# EAGLE schematic TR4 (EAGLE 9.6.2)
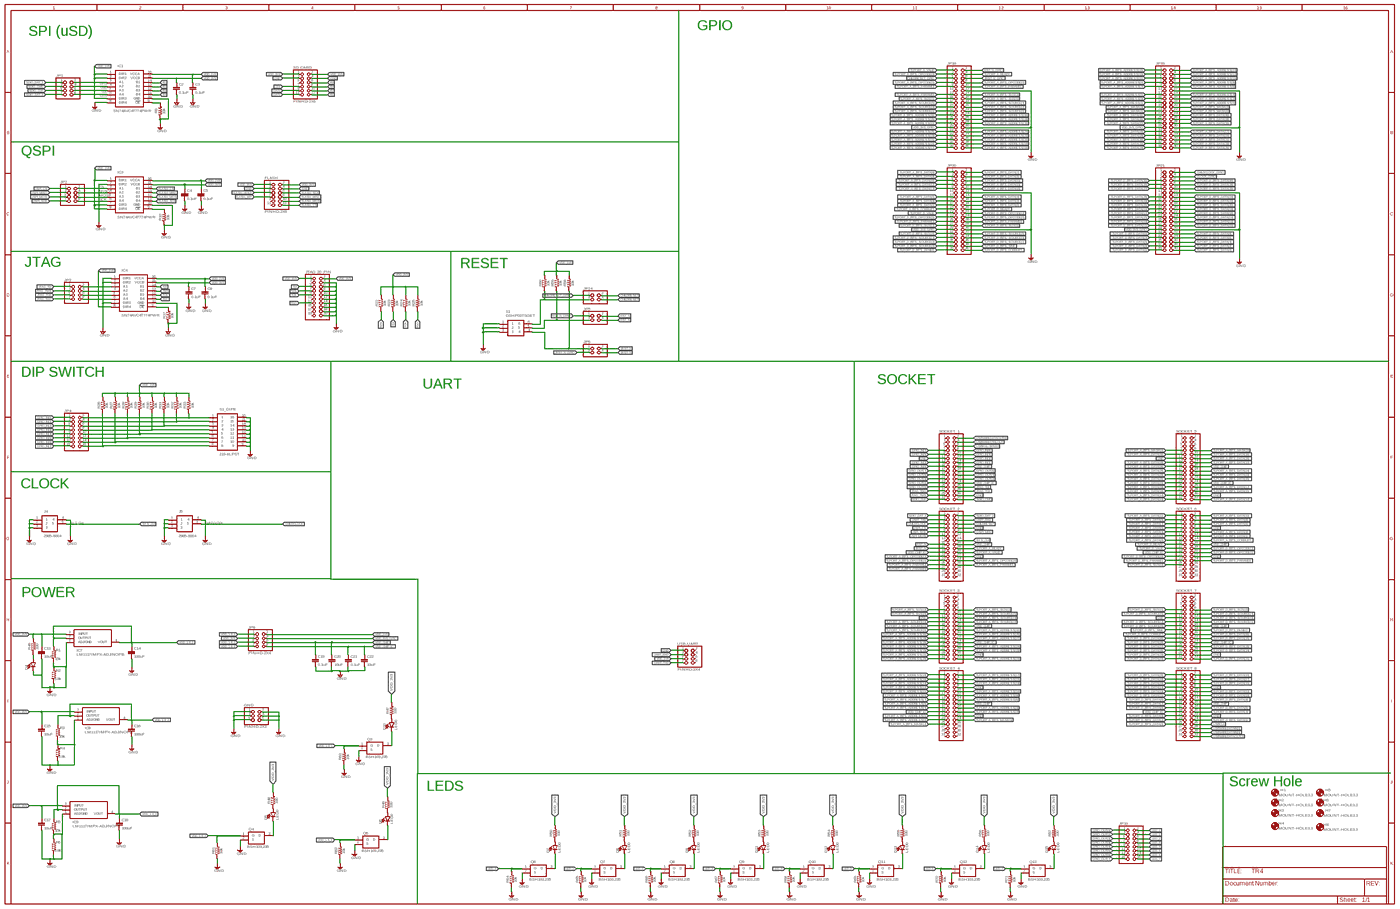
[diagram p0: schematic, sheet 1, overview]
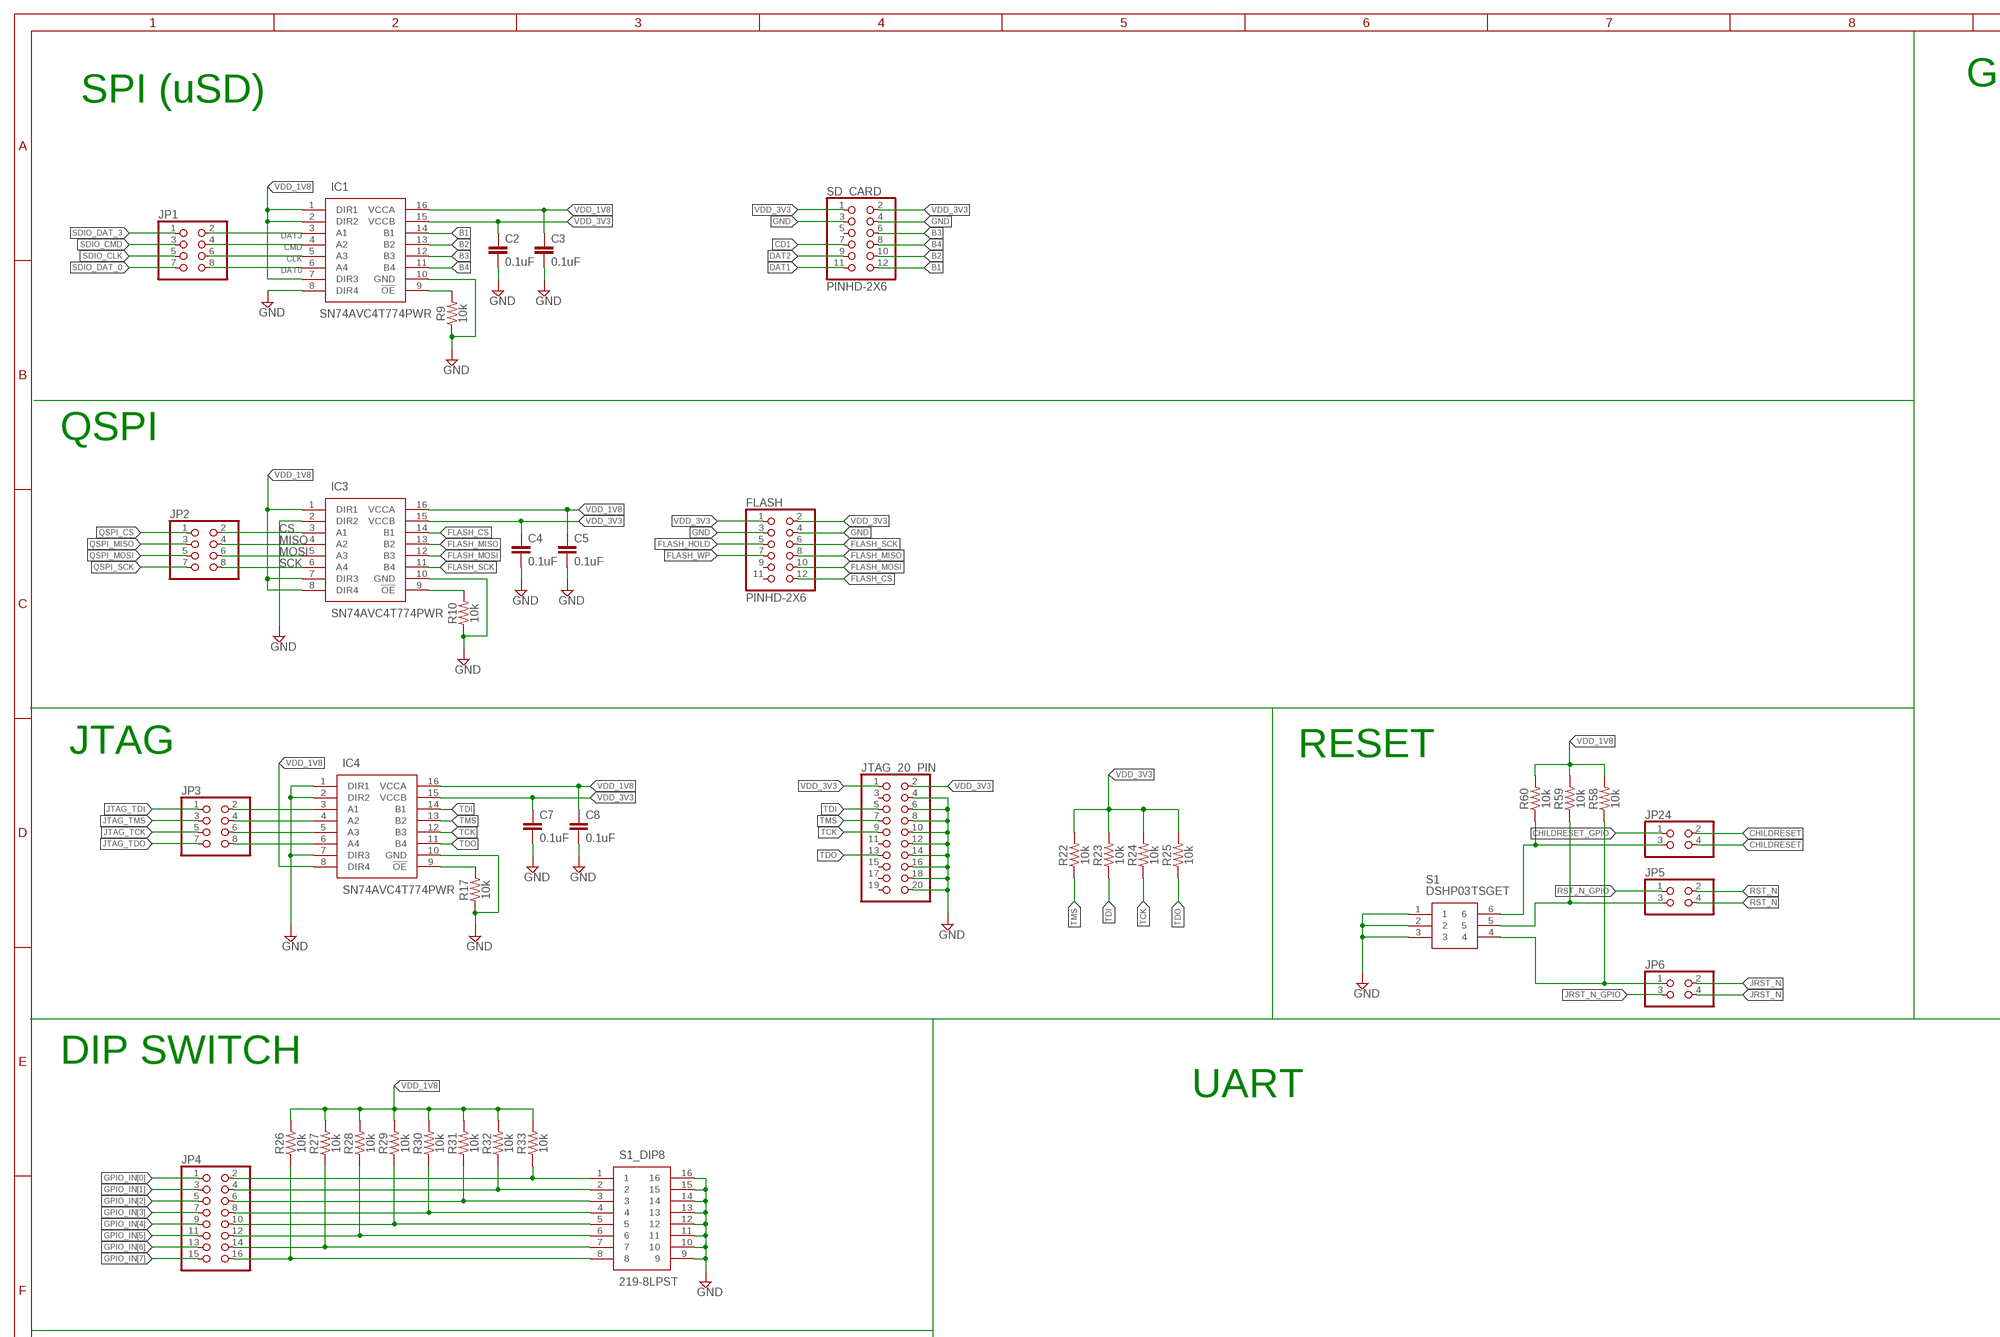
[diagram p1: schematic, sheet 1, part 1 of 4]
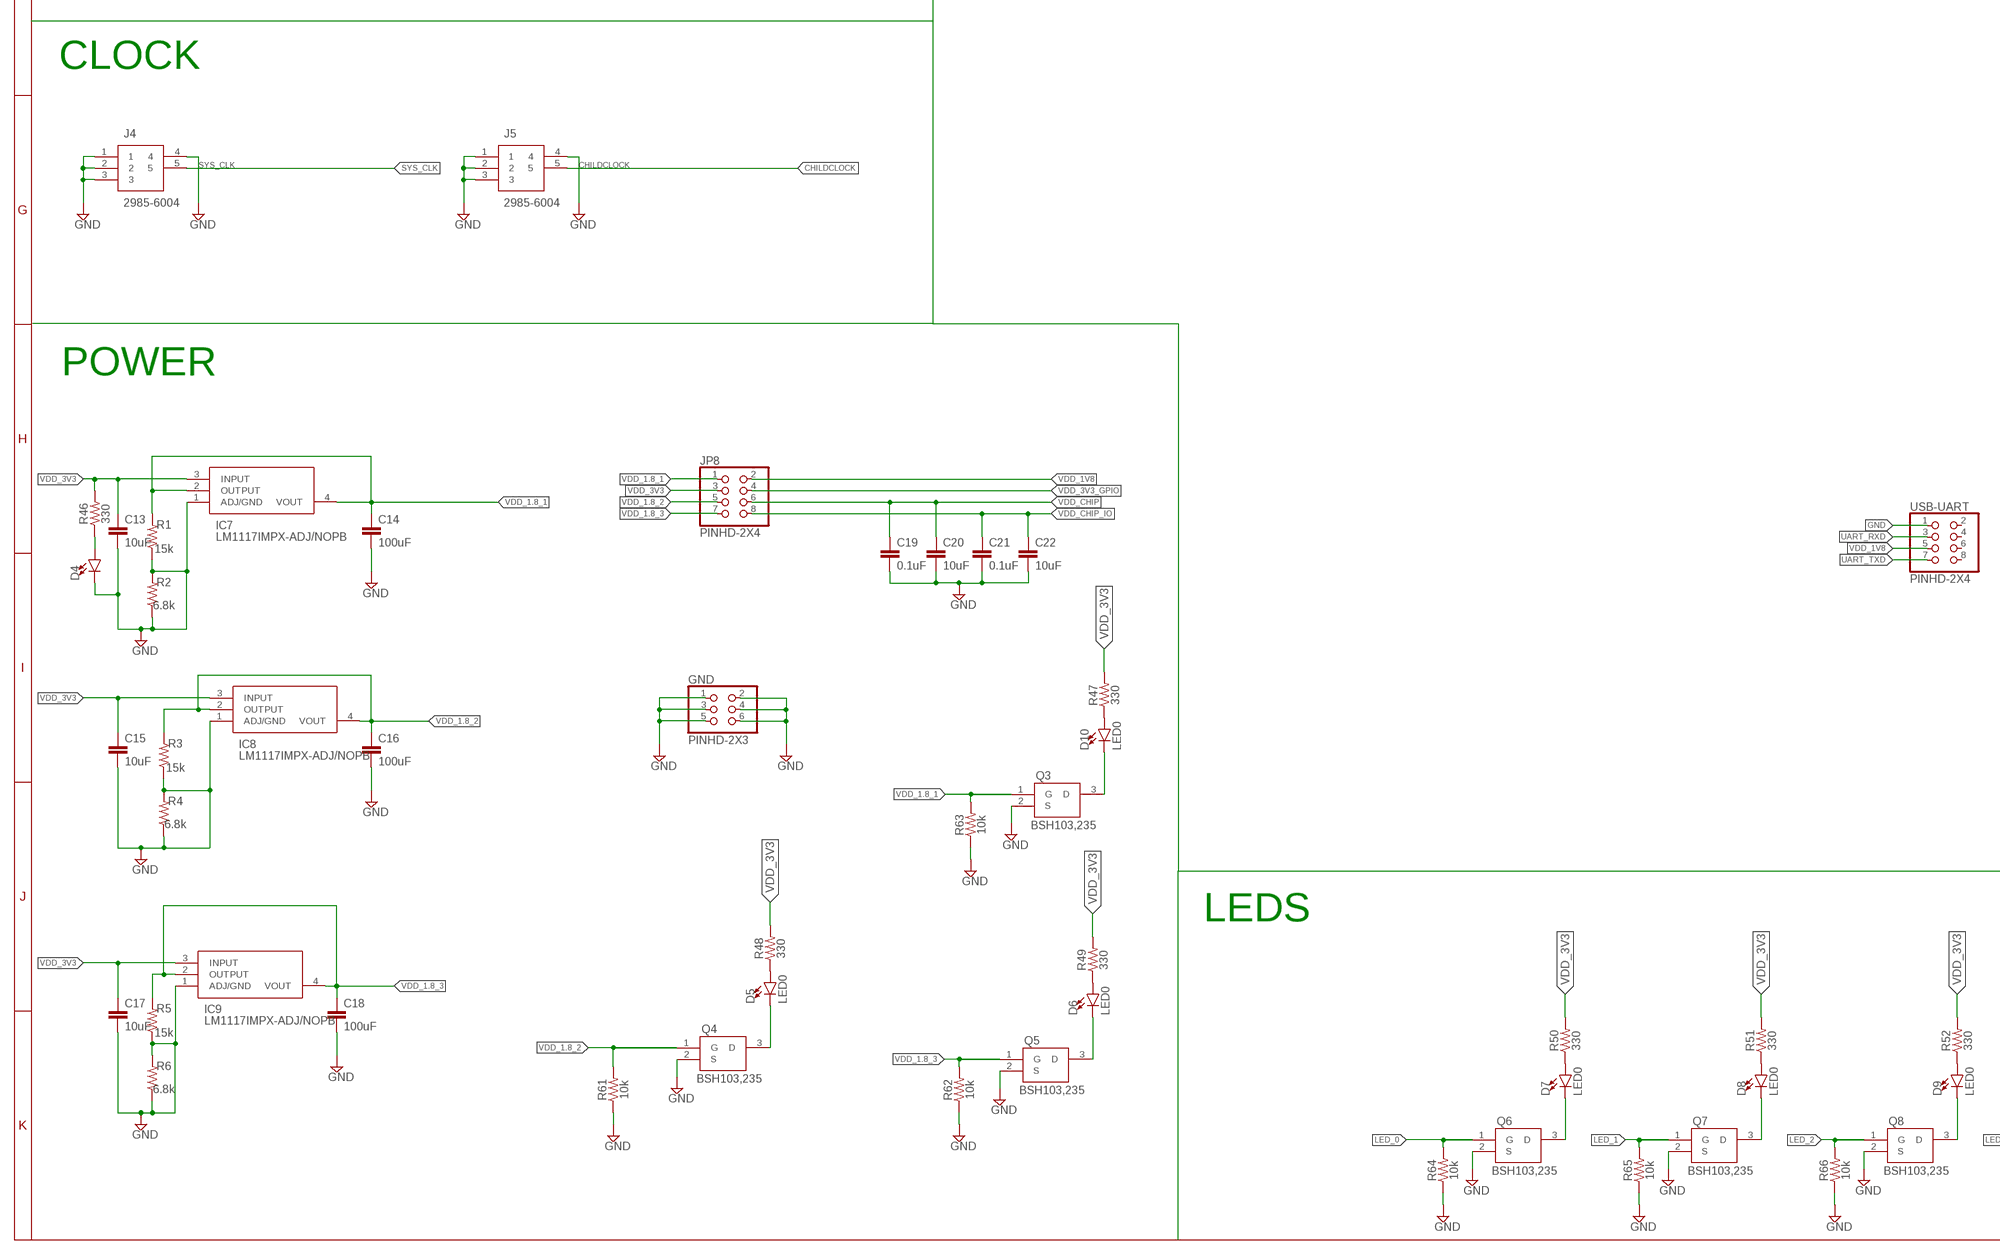
[diagram p2: schematic, sheet 1, part 2 of 4]
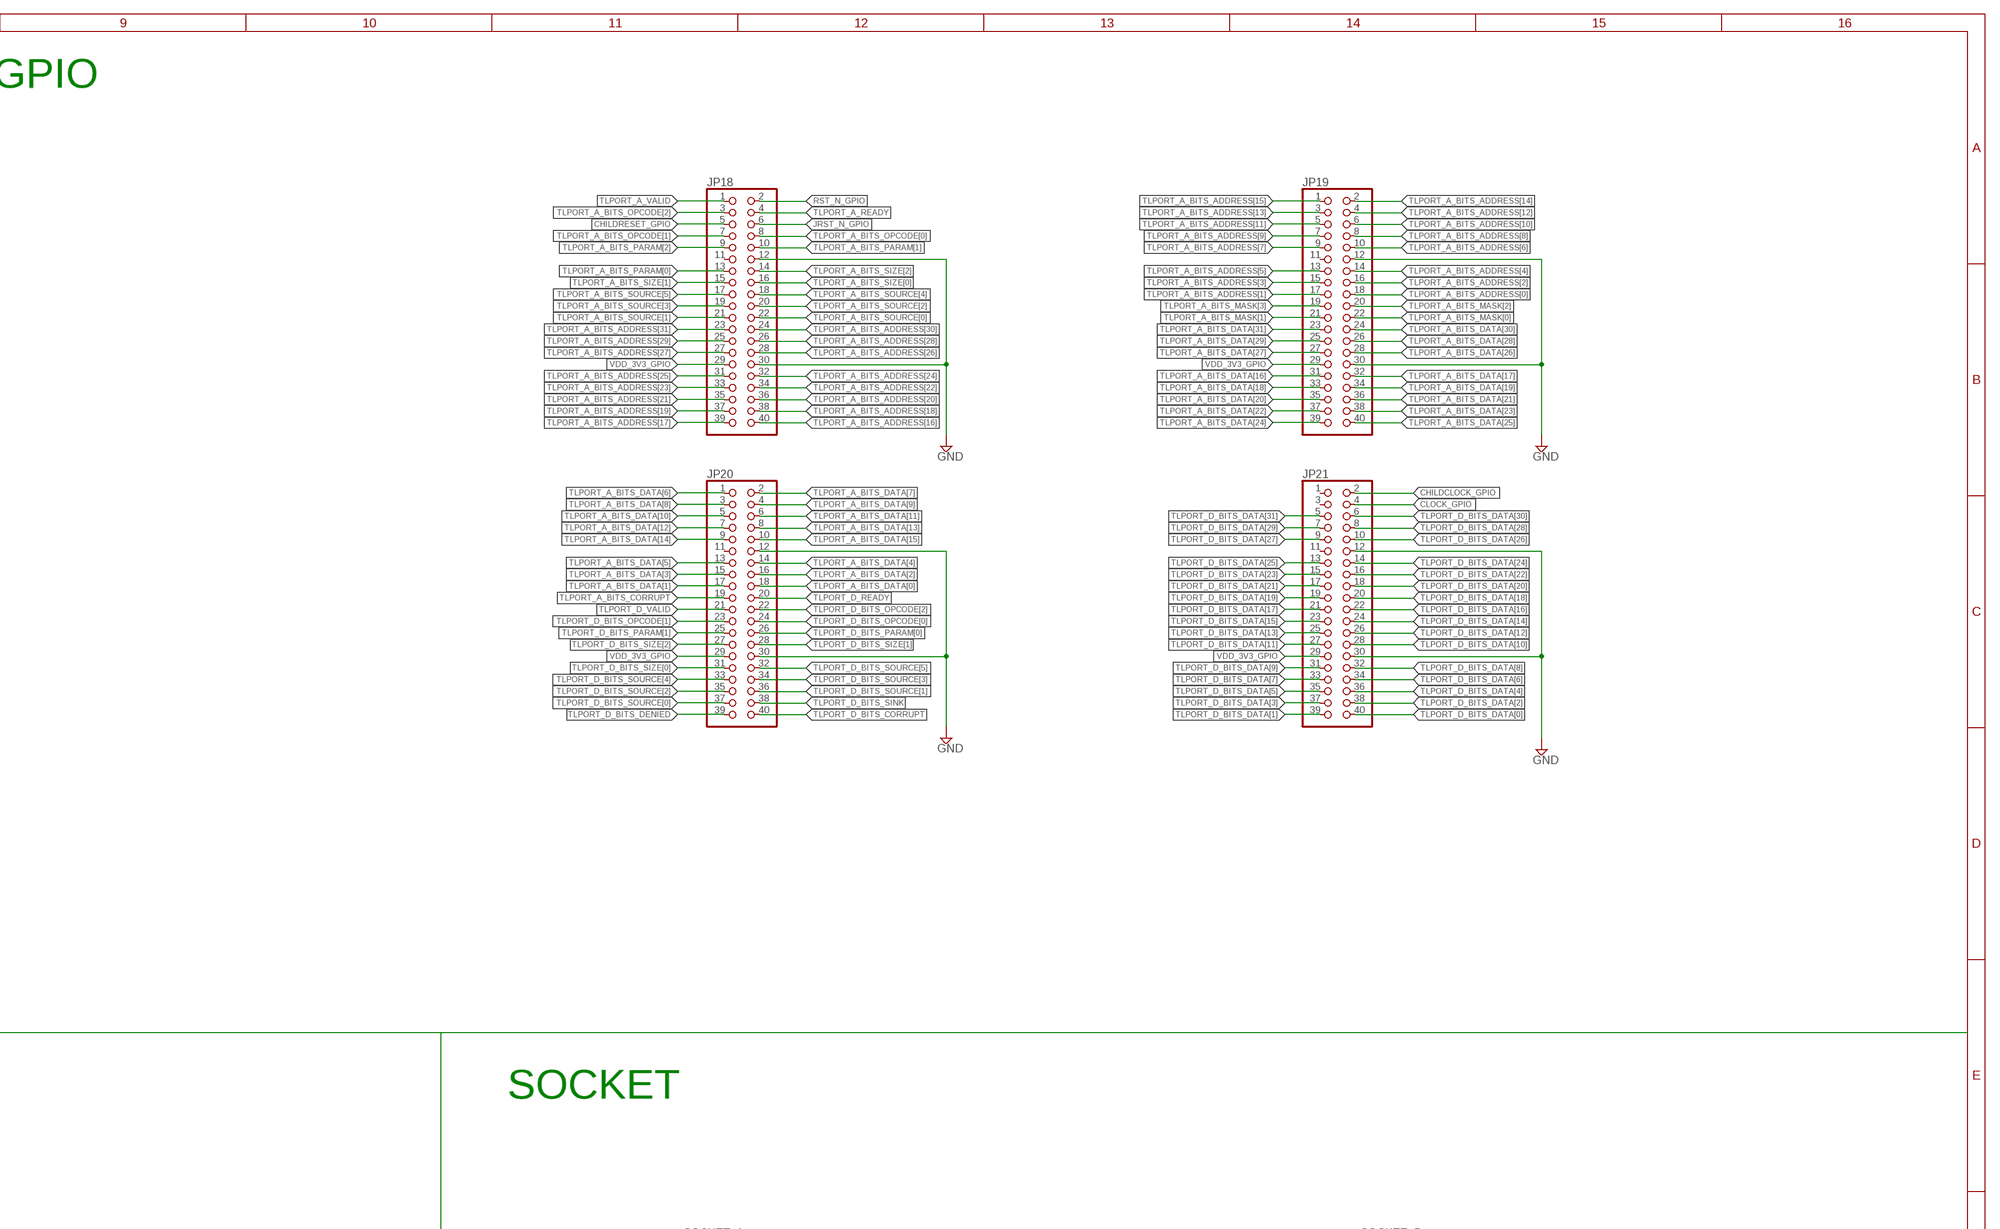
[diagram p3: schematic, sheet 1, part 3 of 4]
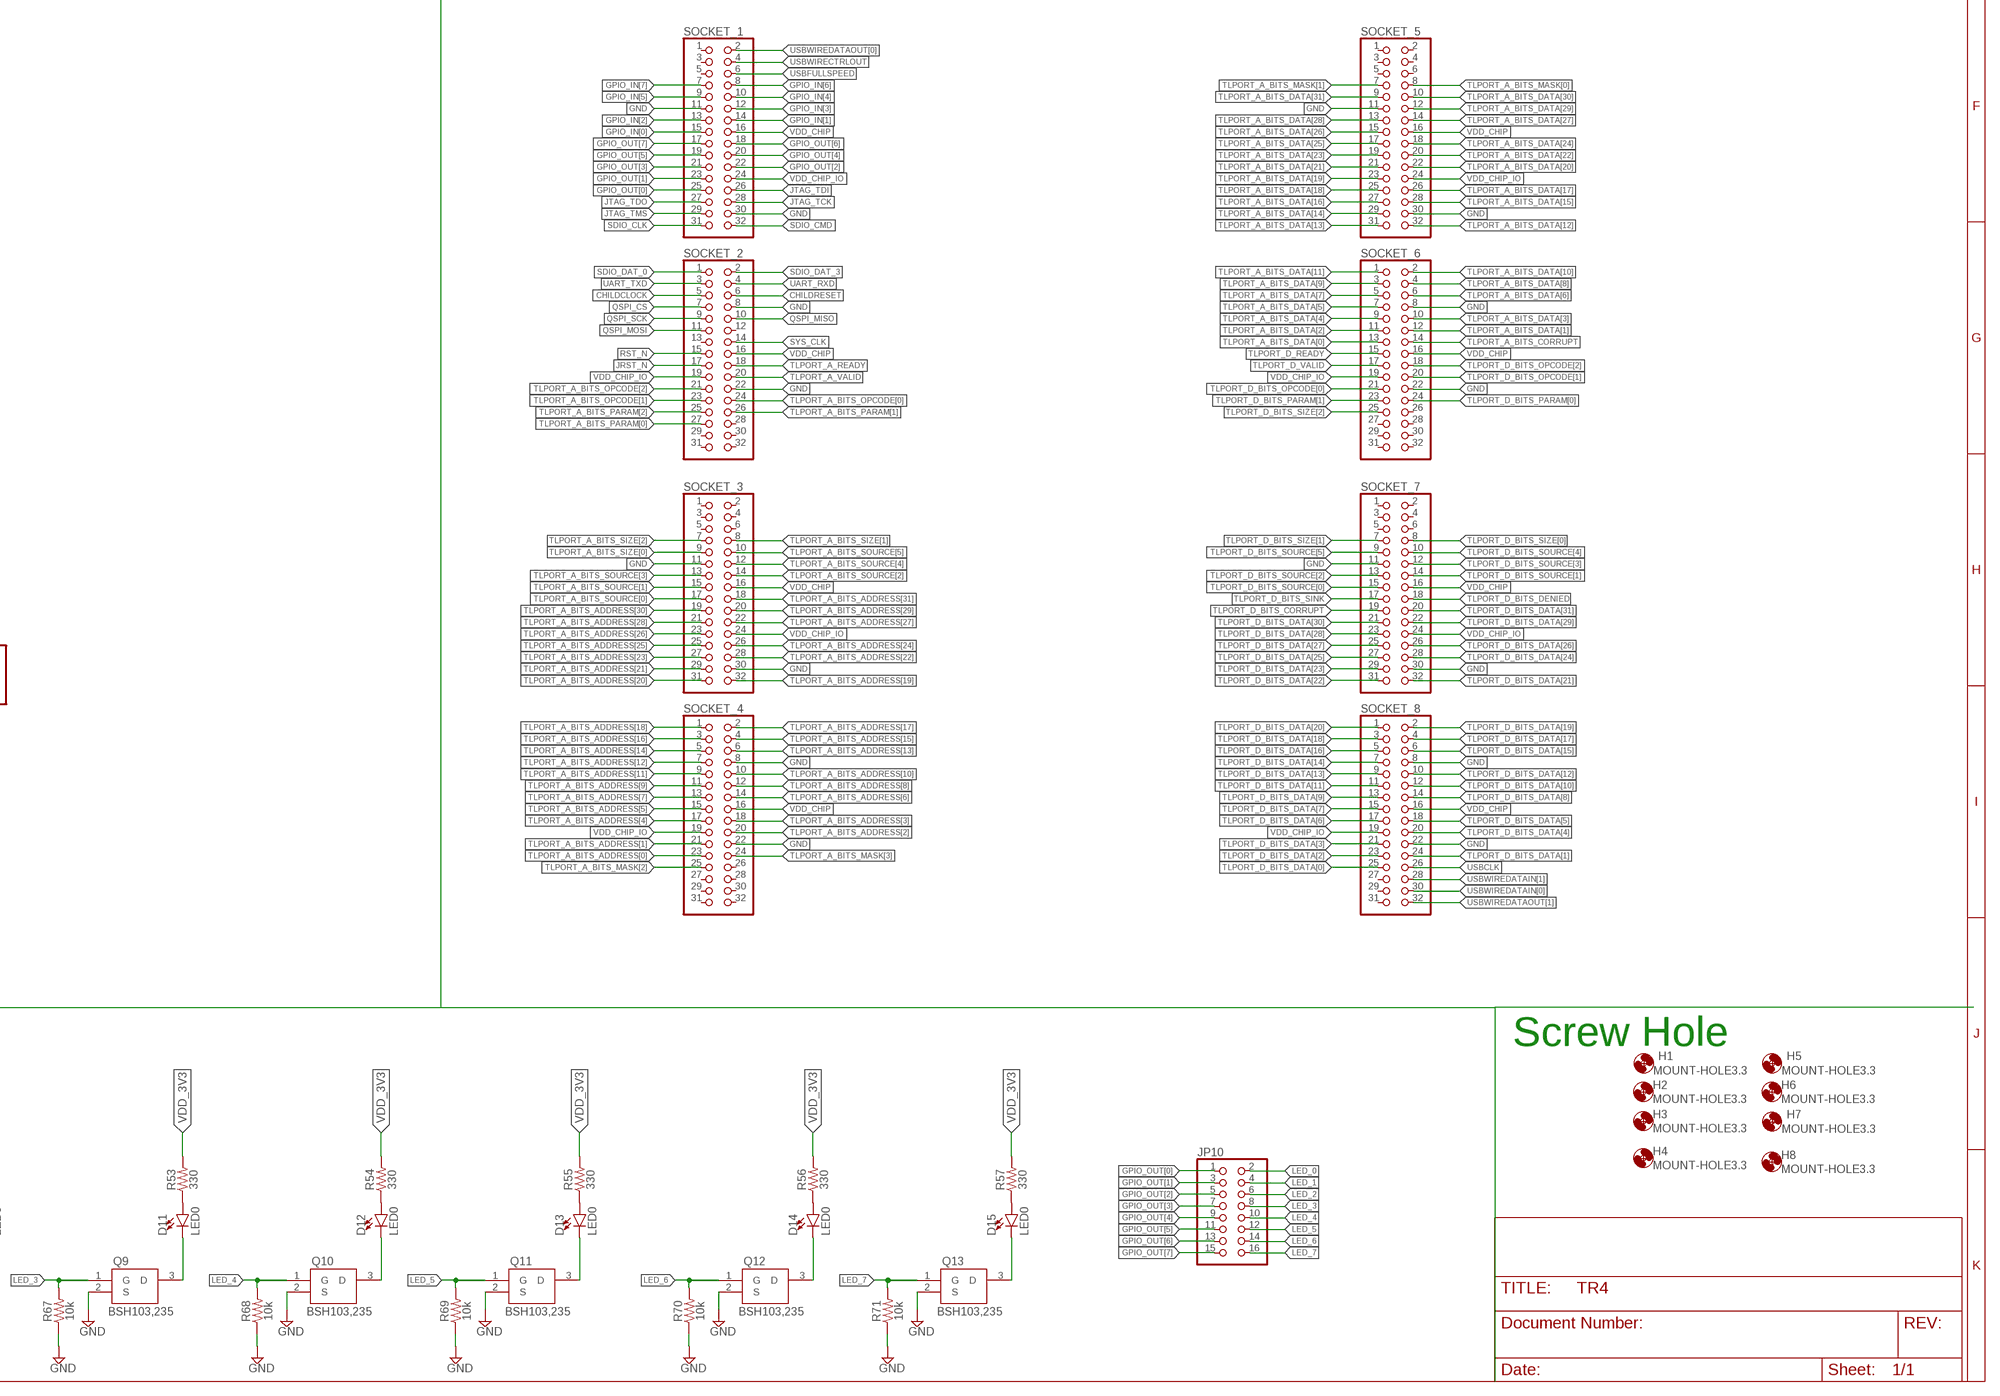
[diagram p4: schematic, sheet 1, part 4 of 4]

## Parts
C2  0.1uF  0.1UF-0603-25V-5%  [0603]
C3  0.1uF  0.1UF-0603-25V-5%  [0603]
C4  0.1uF  0.1UF-0603-25V-5%  [0603]
C5  0.1uF  0.1UF-0603-25V-5%  [0603]
C7  0.1uF  0.1UF-0603-25V-5%  [0603]
C8  0.1uF  0.1UF-0603-25V-5%  [0603]
C13  10uF  10UF-0603-6.3V-20%  [0603]
C14  100uF  10UF-0603-6.3V-20%  [0603]
C15  10uF  10UF-0603-6.3V-20%  [0603]
C16  100uF  10UF-0603-6.3V-20%  [0603]
C17  10uF  10UF-0603-6.3V-20%  [0603]
C18  100uF  10UF-0603-6.3V-20%  [0603]
C19  0.1uF  0.1UF-0603-25V-5%  [0603]
C20  10uF  10UF-0603-6.3V-20%  [0603]
C21  0.1uF  0.1UF-0603-25V-5%  [0603]
C22  10uF  10UF-0603-6.3V-20%  [0603]
D4  LED0603  [LED-0603]
D5  LED0  LED0603  [LED-0603]
D6  LED0  LED0603  [LED-0603]
D7  LED0  LED0603  [LED-0603]
D8  LED0  LED0603  [LED-0603]
D9  LED0  LED0603  [LED-0603]
D10  LED0  LED0603  [LED-0603]
D11  LED0  LED0603  [LED-0603]
D12  LED0  LED0603  [LED-0603]
D13  LED0  LED0603  [LED-0603]
D14  LED0  LED0603  [LED-0603]
D15  LED0  LED0603  [LED-0603]
FLASH  PINHD-2X6  [2X06]
GND  PINHD-2X3  [2X03]
H1  MOUNT-HOLE3.3  [3,3]
H2  MOUNT-HOLE3.3  [3,3]
H3  MOUNT-HOLE3.3  [3,3]
H4  MOUNT-HOLE3.3  [3,3]
H5  MOUNT-HOLE3.3  [3,3]
H6  MOUNT-HOLE3.3  [3,3]
H7  MOUNT-HOLE3.3  [3,3]
H8  MOUNT-HOLE3.3  [3,3]
IC1  SN74AVC4T774PWR  [SOP65P640X120-16N]
IC3  SN74AVC4T774PWR  [SOP65P640X120-16N]
IC4  SN74AVC4T774PWR  [SOP65P640X120-16N]
IC7  LM1117IMPX-ADJ/NOPB  LM1117MP-1.8_NOPB  [SOT230P700X180-4N]
IC8  LM1117IMPX-ADJ/NOPB  LM1117MP-1.8_NOPB  [SOT230P700X180-4N]
IC9  LM1117IMPX-ADJ/NOPB  LM1117MP-1.8_NOPB  [SOT230P700X180-4N]
J4  2985-6004  [29856004]
J5  2985-6004  [29856004]
JP1  PINHD-2X4  [2X04]
JP2  PINHD-2X4  [2X04]
JP3  PINHD-2X4  [2X04]
JP4  PINHD-2X8  [2X08]
JP5  PINHD-2X2  [2X02]
JP6  PINHD-2X2  [2X02]
JP8  PINHD-2X4  [2X04]
JP10  PINHD-2X8  [2X08]
JP18  PINHD-2X20  [2X20]
JP19  PINHD-2X20  [2X20]
JP20  PINHD-2X20  [2X20]
JP21  PINHD-2X20  [2X20]
JP24  PINHD-2X2  [2X02]
JTAG_20_PIN  PINHD-2X10  [2X10]
Q3  BSH103,235  [SOT95P230X110-3N]
Q4  BSH103,235  [SOT95P230X110-3N]
Q5  BSH103,235  [SOT95P230X110-3N]
Q6  BSH103,235  [SOT95P230X110-3N]
Q7  BSH103,235  [SOT95P230X110-3N]
Q8  BSH103,235  [SOT95P230X110-3N]
Q9  BSH103,235  [SOT95P230X110-3N]
Q10  BSH103,235  [SOT95P230X110-3N]
Q11  BSH103,235  [SOT95P230X110-3N]
Q12  BSH103,235  [SOT95P230X110-3N]
Q13  BSH103,235  [SOT95P230X110-3N]
R1  15k  15KOHM-0603-1/10W-1%  [0603]
R2  6.8k  6.8KOHM-0603-1/10W-1%  [0603]
R3  15k  15KOHM-0603-1/10W-1%  [0603]
R4  6.8k  6.8KOHM-0603-1/10W-1%  [0603]
R5  15k  15KOHM-0603-1/10W-1%  [0603]
R6  6.8k  6.8KOHM-0603-1/10W-1%  [0603]
R9  10k  10KOHM-0603-1/10W-1%  [0603]
R10  10k  10KOHM-0603-1/10W-1%  [0603]
R17  10k  10KOHM-0603-1/10W-1%  [0603]
R22  10k  10KOHM-0603-1/10W-1%  [0603]
R23  10k  10KOHM-0603-1/10W-1%  [0603]
R24  10k  10KOHM-0603-1/10W-1%  [0603]
R25  10k  10KOHM-0603-1/10W-1%  [0603]
R26  10k  10KOHM-0603-1/10W-1%  [0603]
R27  10k  10KOHM-0603-1/10W-1%  [0603]
R28  10k  10KOHM-0603-1/10W-1%  [0603]
R29  10k  10KOHM-0603-1/10W-1%  [0603]
R30  10k  10KOHM-0603-1/10W-1%  [0603]
R31  10k  10KOHM-0603-1/10W-1%  [0603]
R32  10k  10KOHM-0603-1/10W-1%  [0603]
R33  10k  10KOHM-0603-1/10W-1%  [0603]
R46  330  330OHM-0603-1/10W-1%  [0603]
R47  330  330OHM-0603-1/10W-1%  [0603]
R48  330  330OHM-0603-1/10W-1%  [0603]
R49  330  330OHM-0603-1/10W-1%  [0603]
R50  330  330OHM-0603-1/10W-1%  [0603]
R51  330  330OHM-0603-1/10W-1%  [0603]
R52  330  330OHM-0603-1/10W-1%  [0603]
R53  330  330OHM-0603-1/10W-1%  [0603]
R54  330  330OHM-0603-1/10W-1%  [0603]
R55  330  330OHM-0603-1/10W-1%  [0603]
R56  330  330OHM-0603-1/10W-1%  [0603]
R57  330  330OHM-0603-1/10W-1%  [0603]
R58  10k  10KOHM-0603-1/10W-1%  [0603]
R59  10k  10KOHM-0603-1/10W-1%  [0603]
R60  10k  10KOHM-0603-1/10W-1%  [0603]
R61  10k  10KOHM-0603-1/10W-1%  [0603]
R62  10k  10KOHM-0603-1/10W-1%  [0603]
R63  10k  10KOHM-0603-1/10W-1%  [0603]
R64  10k  10KOHM-0603-1/10W-1%  [0603]
R65  10k  10KOHM-0603-1/10W-1%  [0603]
R66  10k  10KOHM-0603-1/10W-1%  [0603]
R67  10k  10KOHM-0603-1/10W-1%  [0603]
R68  10k  10KOHM-0603-1/10W-1%  [0603]
R69  10k  10KOHM-0603-1/10W-1%  [0603]
R70  10k  10KOHM-0603-1/10W-1%  [0603]
R71  10k  10KOHM-0603-1/10W-1%  [0603]
S1  DSHP03TSGET  [SOT127P835X260-6N]
S1_DIP8  219-8LPST  [2198LPST]
SD_CARD  PINHD-2X6  [2X06]
SOCKET_1  PINHD-2X16  [2X16]
SOCKET_2  PINHD-2X16  [2X16]
SOCKET_3  PINHD-2X16  [2X16]
SOCKET_4  PINHD-2X16  [2X16]
SOCKET_5  PINHD-2X16  [2X16]
SOCKET_6  PINHD-2X16  [2X16]
SOCKET_7  PINHD-2X16  [2X16]
SOCKET_8  PINHD-2X16  [2X16]
USB-UART  PINHD-2X4  [2X04]

## Nets
B1: IC1.14(B1) SD_CARD.12
B2: IC1.13(B2) SD_CARD.10
B3: IC1.12(B3) SD_CARD.6
B4: IC1.11(B4) SD_CARD.8
CD1: SD_CARD.7
CHILDCLOCK: J5.5 SOCKET_2.5
CHILDCLOCK_GPIO: JP21.2
CHILDRESET: JP24.2 JP24.4 SOCKET_2.6
CHILDRESET_GPIO: JP18.5 JP24.1
CLK: IC1.5(A3) JP1.6
CLOCK_GPIO: JP21.4
CMD: IC1.4(A2) JP1.4
CS: IC3.3(A1) JP2.2
DAT0: IC1.6(A4) JP1.8
DAT1: SD_CARD.11
DAT2: SD_CARD.9
DAT3: IC1.3(A1) JP1.2
FLASH_CS: FLASH.12 IC3.14(B1)
FLASH_HOLD: FLASH.5
FLASH_MISO: FLASH.8 IC3.13(B2)
FLASH_MOSI: FLASH.10 IC3.12(B3)
FLASH_SCK: FLASH.6 IC3.11(B4)
FLASH_WP: FLASH.7
GND: C2.2 C3.2 C4.2 C5.2 C7.2 C8.2 C13.2 C14.2 C15.2 C16.2 C17.2 C18.2 C19.2 C20.2 C21.2 C22.2 D4.C FLASH.3 FLASH.4 GND.1 GND.2 GND.3 GND.4 GND.5 GND.6 IC1.8(DIR4) IC1.10(GND) IC3.2(DIR2) IC3.10(GND) IC4.1(DIR1) IC4.2(DIR2) IC4.7(DIR3) IC4.10(GND) IC7.1(ADJ/GND) IC8.1(ADJ/GND) IC9.1(ADJ/GND) J4.1 J4.2 J4.3 J4.4 J5.1 J5.2 J5.3 J5.4 JP18.12 JP18.30 JP19.12 JP19.30 JP20.12 JP20.30 JP21.12 JP21.30 JTAG_20_PIN.4 JTAG_20_PIN.6 JTAG_20_PIN.8 JTAG_20_PIN.10 JTAG_20_PIN.12 JTAG_20_PIN.14 JTAG_20_PIN.16 JTAG_20_PIN.18 JTAG_20_PIN.20 Q3.2(S) Q4.2(S) Q5.2(S) Q6.2(S) Q7.2(S) Q8.2(S) Q9.2(S) Q10.2(S) Q11.2(S) Q12.2(S) Q13.2(S) R1.1 R2.1 R2.2 R3.1 R4.1 R4.2 R5.1 R6.1 R6.2 R9.1 R10.1 R17.1 R61.1 R62.1 R63.1 R64.1 R65.1 R66.1 R67.1 R68.1 R69.1 R70.1 R71.1 S1.1 S1.2 S1.3 S1_DIP8.9 S1_DIP8.10 S1_DIP8.11 S1_DIP8.12 S1_DIP8.13 S1_DIP8.14 S1_DIP8.15 S1_DIP8.16 SD_CARD.3 SD_CARD.4 SOCKET_1.11 SOCKET_1.30 SOCKET_2.8 SOCKET_2.22 SOCKET_3.11 SOCKET_3.30 SOCKET_4.8 SOCKET_4.22 SOCKET_5.11 SOCKET_5.30 SOCKET_6.8 SOCKET_6.22 SOCKET_7.11 SOCKET_7.30 SOCKET_8.8 SOCKET_8.22 USB-UART.1
GPIO_IN[0]: JP4.1 SOCKET_1.15
GPIO_IN[1]: JP4.3 SOCKET_1.14
GPIO_IN[2]: JP4.5 SOCKET_1.13
GPIO_IN[3]: JP4.7 SOCKET_1.12
GPIO_IN[4]: JP4.9 SOCKET_1.10
GPIO_IN[5]: JP4.11 SOCKET_1.9
GPIO_IN[6]: JP4.13 SOCKET_1.8
GPIO_IN[7]: JP4.15 SOCKET_1.7
GPIO_OUT[0]: JP10.1 SOCKET_1.25
GPIO_OUT[1]: JP10.3 SOCKET_1.23
GPIO_OUT[2]: JP10.5 SOCKET_1.22
GPIO_OUT[3]: JP10.7 SOCKET_1.21
GPIO_OUT[4]: JP10.9 SOCKET_1.20
GPIO_OUT[5]: JP10.11 SOCKET_1.19
GPIO_OUT[6]: JP10.13 SOCKET_1.18
GPIO_OUT[7]: JP10.15 SOCKET_1.17
JRST_N: JP6.2 JP6.4 SOCKET_2.17
JRST_N_GPIO: JP6.3 JP18.6
JTAG_TCK: JP3.5 SOCKET_1.28
JTAG_TDI: JP3.1 SOCKET_1.26
JTAG_TDO: JP3.7 SOCKET_1.27
JTAG_TMS: JP3.3 SOCKET_1.29
LED_0: JP10.2 Q6.1(G) R64.2
LED_1: JP10.4 Q7.1(G) R65.2
LED_2: JP10.6 Q8.1(G) R66.2
LED_3: JP10.8 Q9.1(G) R67.2
LED_4: JP10.10 Q10.1(G) R68.2
LED_5: JP10.12 Q11.1(G) R69.2
LED_6: JP10.14 Q12.1(G) R70.2
LED_7: JP10.16 Q13.1(G) R71.2
MISO: IC3.4(A2) JP2.4
MOSI: IC3.5(A3) JP2.6
N$9: IC1.9(!OE) R9.2
N$10: IC3.9(!OE) R10.2
N$12: IC4.3(A1) JP3.2
N$13: IC4.4(A2) JP3.4
N$14: IC4.5(A3) JP3.6
N$15: IC4.6(A4) JP3.8
N$16: IC4.9(!OE) R17.2
N$17: JP4.2 R33.1 S1_DIP8.1
N$18: JP4.4 R32.1 S1_DIP8.2
N$19: JP4.6 R31.1 S1_DIP8.3
N$20: JP4.8 R30.1 S1_DIP8.4
N$21: JP4.10 R29.1 S1_DIP8.5
N$22: JP4.12 R28.1 S1_DIP8.6
N$23: JP4.14 R27.1 S1_DIP8.7
N$24: JP4.16 R26.1 S1_DIP8.8
N$26: JP5.3 R59.1 S1.5
N$28: JP24.3 R60.1 S1.6
N$38: D4.A R46.1
N$39: D10.A R47.1
N$40: D10.C Q3.3(D)
N$44: JP6.1 R58.1 S1.4
N$45: D5.A R48.1
N$46: D5.C Q4.3(D)
N$47: D6.A R49.1
N$48: D6.C Q5.3(D)
N$249: D7.A R50.1
N$250: D7.C Q6.3(D)
N$251: D8.A R51.1
N$252: D8.C Q7.3(D)
N$253: D9.A R52.1
N$254: D9.C Q8.3(D)
N$255: D11.A R53.1
N$256: D11.C Q9.3(D)
N$257: D12.A R54.1
N$258: D12.C Q10.3(D)
N$259: D13.A R55.1
N$260: D13.C Q11.3(D)
N$261: D14.A R56.1
N$262: D14.C Q12.3(D)
N$263: D15.A R57.1
N$264: D15.C Q13.3(D)
QSPI_CS: JP2.1 SOCKET_2.7
QSPI_MISO: JP2.3 SOCKET_2.10
QSPI_MOSI: JP2.5 SOCKET_2.11
QSPI_SCK: JP2.7 SOCKET_2.9
RST_N: JP5.2 JP5.4 SOCKET_2.15
RST_N_GPIO: JP5.1 JP18.2
SCK: IC3.6(A4) JP2.8
SDIO_CLK: JP1.5 SOCKET_1.31
SDIO_CMD: JP1.3 SOCKET_1.32
SDIO_DAT_0: JP1.7 SOCKET_2.1
SDIO_DAT_3: JP1.1 SOCKET_2.2
SYS_CLK: J4.5 SOCKET_2.14
TCK: IC4.12(B3) JTAG_20_PIN.9 R24.1
TDI: IC4.14(B1) JTAG_20_PIN.5 R23.1
TDO: IC4.11(B4) JTAG_20_PIN.13 R25.1
TLPORT_A_BITS_ADDRESS[0]: JP19.18 SOCKET_4.23
TLPORT_A_BITS_ADDRESS[1]: JP19.17 SOCKET_4.21
TLPORT_A_BITS_ADDRESS[2]: JP19.16 SOCKET_4.20
TLPORT_A_BITS_ADDRESS[3]: JP19.15 SOCKET_4.18
TLPORT_A_BITS_ADDRESS[4]: JP19.14 SOCKET_4.17
TLPORT_A_BITS_ADDRESS[5]: JP19.13 SOCKET_4.15
TLPORT_A_BITS_ADDRESS[6]: JP19.10 SOCKET_4.14
TLPORT_A_BITS_ADDRESS[7]: JP19.9 SOCKET_4.13
TLPORT_A_BITS_ADDRESS[8]: JP19.8 SOCKET_4.12
TLPORT_A_BITS_ADDRESS[9]: JP19.7 SOCKET_4.11
TLPORT_A_BITS_ADDRESS[10]: JP19.6 SOCKET_4.10
TLPORT_A_BITS_ADDRESS[11]: JP19.5 SOCKET_4.9
TLPORT_A_BITS_ADDRESS[12]: JP19.4 SOCKET_4.7
TLPORT_A_BITS_ADDRESS[13]: JP19.3 SOCKET_4.6
TLPORT_A_BITS_ADDRESS[14]: JP19.2 SOCKET_4.5
TLPORT_A_BITS_ADDRESS[15]: JP19.1 SOCKET_4.4
TLPORT_A_BITS_ADDRESS[16]: JP18.40 SOCKET_4.3
TLPORT_A_BITS_ADDRESS[17]: JP18.39 SOCKET_4.2
TLPORT_A_BITS_ADDRESS[18]: JP18.38 SOCKET_4.1
TLPORT_A_BITS_ADDRESS[19]: JP18.37 SOCKET_3.32
TLPORT_A_BITS_ADDRESS[20]: JP18.36 SOCKET_3.31
TLPORT_A_BITS_ADDRESS[21]: JP18.35 SOCKET_3.29
TLPORT_A_BITS_ADDRESS[22]: JP18.34 SOCKET_3.28
TLPORT_A_BITS_ADDRESS[23]: JP18.33 SOCKET_3.27
TLPORT_A_BITS_ADDRESS[24]: JP18.32 SOCKET_3.26
TLPORT_A_BITS_ADDRESS[25]: JP18.31 SOCKET_3.25
TLPORT_A_BITS_ADDRESS[26]: JP18.28 SOCKET_3.23
TLPORT_A_BITS_ADDRESS[27]: JP18.27 SOCKET_3.22
TLPORT_A_BITS_ADDRESS[28]: JP18.26 SOCKET_3.21
TLPORT_A_BITS_ADDRESS[29]: JP18.25 SOCKET_3.20
TLPORT_A_BITS_ADDRESS[30]: JP18.24 SOCKET_3.19
TLPORT_A_BITS_ADDRESS[31]: JP18.23 SOCKET_3.18
TLPORT_A_BITS_CORRUPT: JP20.19 SOCKET_6.14
TLPORT_A_BITS_DATA[0]: JP20.18 SOCKET_6.13
TLPORT_A_BITS_DATA[1]: JP20.17 SOCKET_6.12
TLPORT_A_BITS_DATA[2]: JP20.16 SOCKET_6.11
TLPORT_A_BITS_DATA[3]: JP20.15 SOCKET_6.10
TLPORT_A_BITS_DATA[4]: JP20.14 SOCKET_6.9
TLPORT_A_BITS_DATA[5]: JP20.13 SOCKET_6.7
TLPORT_A_BITS_DATA[6]: JP20.1 SOCKET_6.6
TLPORT_A_BITS_DATA[7]: JP20.2 SOCKET_6.5
TLPORT_A_BITS_DATA[8]: JP20.3 SOCKET_6.4
TLPORT_A_BITS_DATA[9]: JP20.4 SOCKET_6.3
TLPORT_A_BITS_DATA[10]: JP20.5 SOCKET_6.2
TLPORT_A_BITS_DATA[11]: JP20.6 SOCKET_6.1
TLPORT_A_BITS_DATA[12]: JP20.7 SOCKET_5.32
TLPORT_A_BITS_DATA[13]: JP20.8 SOCKET_5.31
TLPORT_A_BITS_DATA[14]: JP20.9 SOCKET_5.29
TLPORT_A_BITS_DATA[15]: JP20.10 SOCKET_5.28
TLPORT_A_BITS_DATA[16]: JP19.31 SOCKET_5.27
TLPORT_A_BITS_DATA[17]: JP19.32 SOCKET_5.26
TLPORT_A_BITS_DATA[18]: JP19.33 SOCKET_5.25
TLPORT_A_BITS_DATA[19]: JP19.34 SOCKET_5.23
TLPORT_A_BITS_DATA[20]: JP19.35 SOCKET_5.22
TLPORT_A_BITS_DATA[21]: JP19.36 SOCKET_5.21
TLPORT_A_BITS_DATA[22]: JP19.37 SOCKET_5.20
TLPORT_A_BITS_DATA[23]: JP19.38 SOCKET_5.19
TLPORT_A_BITS_DATA[24]: JP19.39 SOCKET_5.18
TLPORT_A_BITS_DATA[25]: JP19.40 SOCKET_5.17
TLPORT_A_BITS_DATA[26]: JP19.28 SOCKET_5.15
TLPORT_A_BITS_DATA[27]: JP19.27 SOCKET_5.14
TLPORT_A_BITS_DATA[28]: JP19.26 SOCKET_5.13
TLPORT_A_BITS_DATA[29]: JP19.25 SOCKET_5.12
TLPORT_A_BITS_DATA[30]: JP19.24 SOCKET_5.10
TLPORT_A_BITS_DATA[31]: JP19.23 SOCKET_5.9
TLPORT_A_BITS_MASK[0]: JP19.22 SOCKET_5.8
TLPORT_A_BITS_MASK[1]: JP19.21 SOCKET_5.7
TLPORT_A_BITS_MASK[2]: JP19.20 SOCKET_4.25
TLPORT_A_BITS_MASK[3]: JP19.19 SOCKET_4.24
TLPORT_A_BITS_OPCODE[0]: JP18.8 SOCKET_2.24
TLPORT_A_BITS_OPCODE[1]: JP18.7 SOCKET_2.23
TLPORT_A_BITS_OPCODE[2]: JP18.3 SOCKET_2.21
TLPORT_A_BITS_PARAM[0]: JP18.13 SOCKET_2.27
TLPORT_A_BITS_PARAM[1]: JP18.10 SOCKET_2.26
TLPORT_A_BITS_PARAM[2]: JP18.9 SOCKET_2.25
TLPORT_A_BITS_SIZE[0]: JP18.16 SOCKET_3.9
TLPORT_A_BITS_SIZE[1]: JP18.15 SOCKET_3.8
TLPORT_A_BITS_SIZE[2]: JP18.14 SOCKET_3.7
TLPORT_A_BITS_SOURCE[0]: JP18.22 SOCKET_3.17
TLPORT_A_BITS_SOURCE[1]: JP18.21 SOCKET_3.15
TLPORT_A_BITS_SOURCE[2]: JP18.20 SOCKET_3.14
TLPORT_A_BITS_SOURCE[3]: JP18.19 SOCKET_3.13
TLPORT_A_BITS_SOURCE[4]: JP18.18 SOCKET_3.12
TLPORT_A_BITS_SOURCE[5]: JP18.17 SOCKET_3.10
TLPORT_A_READY: JP18.4 SOCKET_2.18
TLPORT_A_VALID: JP18.1 SOCKET_2.20
TLPORT_D_BITS_CORRUPT: JP20.40 SOCKET_7.19
TLPORT_D_BITS_DATA[0]: JP21.40 SOCKET_8.25
TLPORT_D_BITS_DATA[1]: JP21.39 SOCKET_8.24
TLPORT_D_BITS_DATA[2]: JP21.38 SOCKET_8.23
TLPORT_D_BITS_DATA[3]: JP21.37 SOCKET_8.21
TLPORT_D_BITS_DATA[4]: JP21.36 SOCKET_8.20
TLPORT_D_BITS_DATA[5]: JP21.35 SOCKET_8.18
TLPORT_D_BITS_DATA[6]: JP21.34 SOCKET_8.17
TLPORT_D_BITS_DATA[7]: JP21.33 SOCKET_8.15
TLPORT_D_BITS_DATA[8]: JP21.32 SOCKET_8.14
TLPORT_D_BITS_DATA[9]: JP21.31 SOCKET_8.13
TLPORT_D_BITS_DATA[10]: JP21.28 SOCKET_8.12
TLPORT_D_BITS_DATA[11]: JP21.27 SOCKET_8.11
TLPORT_D_BITS_DATA[12]: JP21.26 SOCKET_8.10
TLPORT_D_BITS_DATA[13]: JP21.25 SOCKET_8.9
TLPORT_D_BITS_DATA[14]: JP21.24 SOCKET_8.7
TLPORT_D_BITS_DATA[15]: JP21.23 SOCKET_8.6
TLPORT_D_BITS_DATA[16]: JP21.22 SOCKET_8.5
TLPORT_D_BITS_DATA[17]: JP21.21 SOCKET_8.4
TLPORT_D_BITS_DATA[18]: JP21.20 SOCKET_8.3
TLPORT_D_BITS_DATA[19]: JP21.19 SOCKET_8.2
TLPORT_D_BITS_DATA[20]: JP21.18 SOCKET_8.1
TLPORT_D_BITS_DATA[21]: JP21.17 SOCKET_7.32
TLPORT_D_BITS_DATA[22]: JP21.16 SOCKET_7.31
TLPORT_D_BITS_DATA[23]: JP21.15 SOCKET_7.29
TLPORT_D_BITS_DATA[24]: JP21.14 SOCKET_7.28
TLPORT_D_BITS_DATA[25]: JP21.13 SOCKET_7.27
TLPORT_D_BITS_DATA[26]: JP21.10 SOCKET_7.26
TLPORT_D_BITS_DATA[27]: JP21.9 SOCKET_7.25
TLPORT_D_BITS_DATA[28]: JP21.8 SOCKET_7.23
TLPORT_D_BITS_DATA[29]: JP21.7 SOCKET_7.22
TLPORT_D_BITS_DATA[30]: JP21.6 SOCKET_7.21
TLPORT_D_BITS_DATA[31]: JP21.5 SOCKET_7.20
TLPORT_D_BITS_DENIED: JP20.39 SOCKET_7.18
TLPORT_D_BITS_OPCODE[0]: JP20.24 SOCKET_6.21
TLPORT_D_BITS_OPCODE[1]: JP20.23 SOCKET_6.20
TLPORT_D_BITS_OPCODE[2]: JP20.22 SOCKET_6.18
TLPORT_D_BITS_PARAM[0]: JP20.26 SOCKET_6.24
TLPORT_D_BITS_PARAM[1]: JP20.25 SOCKET_6.23
TLPORT_D_BITS_SINK: JP20.38 SOCKET_7.17
TLPORT_D_BITS_SIZE[0]: JP20.31 SOCKET_7.8
TLPORT_D_BITS_SIZE[1]: JP20.28 SOCKET_7.7
TLPORT_D_BITS_SIZE[2]: JP20.27 SOCKET_6.25
TLPORT_D_BITS_SOURCE[0]: JP20.37 SOCKET_7.15
TLPORT_D_BITS_SOURCE[1]: JP20.36 SOCKET_7.14
TLPORT_D_BITS_SOURCE[2]: JP20.35 SOCKET_7.13
TLPORT_D_BITS_SOURCE[3]: JP20.34 SOCKET_7.12
TLPORT_D_BITS_SOURCE[4]: JP20.33 SOCKET_7.10
TLPORT_D_BITS_SOURCE[5]: JP20.32 SOCKET_7.9
TLPORT_D_READY: JP20.20 SOCKET_6.15
TLPORT_D_VALID: JP20.21 SOCKET_6.17
TMS: IC4.13(B2) JTAG_20_PIN.7 R22.1
UART_RXD: SOCKET_2.4 USB-UART.3
UART_TXD: SOCKET_2.3 USB-UART.7
USBCLK: SOCKET_8.26
USBFULLSPEED: SOCKET_1.6
USBWIRECTRLOUT: SOCKET_1.4
USBWIREDATAIN[0]: SOCKET_8.30
USBWIREDATAIN[1]: SOCKET_8.28
USBWIREDATAOUT[0]: SOCKET_1.2
USBWIREDATAOUT[1]: SOCKET_8.32
VDD_1.8_1: C14.1 IC7.2(OUTPUT) IC7.4(VOUT) JP8.1 Q3.1(G) R1.2 R63.2
VDD_1.8_2: C16.1 IC8.2(OUTPUT) IC8.4(VOUT) JP8.5 Q4.1(G) R3.2 R61.2
VDD_1.8_3: C18.1 IC9.2(OUTPUT) IC9.4(VOUT) JP8.7 Q5.1(G) R5.2 R62.2
VDD_1V8: C3.1 C5.1 C8.1 IC1.1(DIR1) IC1.2(DIR2) IC1.7(DIR3) IC1.16(VCCA) IC3.1(DIR1) IC3.7(DIR3) IC3.8(DIR4) IC3.16(VCCA) IC4.8(DIR4) IC4.16(VCCA) JP8.2 R26.2 R27.2 R28.2 R29.2 R30.2 R31.2 R32.2 R33.2 R58.2 R59.2 R60.2 USB-UART.5
VDD_3V3: C2.1 C4.1 C7.1 C13.1 C15.1 C17.1 FLASH.1 FLASH.2 IC1.15(VCCB) IC3.15(VCCB) IC4.15(VCCB) IC7.3(INPUT) IC8.3(INPUT) IC9.3(INPUT) JP8.3 JTAG_20_PIN.1 JTAG_20_PIN.2 R22.2 R23.2 R24.2 R25.2 R46.2 R47.2 R48.2 R49.2 R50.2 R51.2 R52.2 R53.2 R54.2 R55.2 R56.2 R57.2 SD_CARD.1 SD_CARD.2
VDD_3V3_GPIO: JP8.4 JP18.29 JP19.29 JP20.29 JP21.29
VDD_CHIP: C19.1 C20.1 JP8.6 SOCKET_1.16 SOCKET_2.16 SOCKET_3.16 SOCKET_4.16 SOCKET_5.16 SOCKET_6.16 SOCKET_7.16 SOCKET_8.16
VDD_CHIP_IO: C21.1 C22.1 JP8.8 SOCKET_1.24 SOCKET_2.19 SOCKET_3.24 SOCKET_4.19 SOCKET_5.24 SOCKET_6.19 SOCKET_7.24 SOCKET_8.19
Unconnected: FLASH.9 FLASH.11 JP18.11 JP19.11 JP20.11 JP21.1 JP21.3 JP21.11 JTAG_20_PIN.3 JTAG_20_PIN.11 JTAG_20_PIN.15 JTAG_20_PIN.17 JTAG_20_PIN.19 SD_CARD.5 SOCKET_1.1 SOCKET_1.3 SOCKET_1.5 SOCKET_2.12 SOCKET_2.13 SOCKET_2.28 SOCKET_2.29 SOCKET_2.30 SOCKET_2.31 SOCKET_2.32 SOCKET_3.1 SOCKET_3.2 SOCKET_3.3 SOCKET_3.4 SOCKET_3.5 SOCKET_3.6 SOCKET_4.26 SOCKET_4.27 SOCKET_4.28 SOCKET_4.29 SOCKET_4.30 SOCKET_4.31 SOCKET_4.32 SOCKET_5.1 SOCKET_5.2 SOCKET_5.3 SOCKET_5.4 SOCKET_5.5 SOCKET_5.6 SOCKET_6.26 SOCKET_6.27 SOCKET_6.28 SOCKET_6.29 SOCKET_6.30 SOCKET_6.31 SOCKET_6.32 SOCKET_7.1 SOCKET_7.2 SOCKET_7.3 SOCKET_7.4 SOCKET_7.5 SOCKET_7.6 SOCKET_8.27 SOCKET_8.29 SOCKET_8.31 USB-UART.2 USB-UART.4 USB-UART.6 USB-UART.8

## Notes on the sheet
- GPIO
- SPI (uSD)
- QSPI
- JTAG | RESET
- DIP SWITCH
- SOCKET
- UART
- CLOCK
- POWER
- Screw Hole
- LEDS

## Library data of the parts
C2-C5 C7 C8 C19 C21 = SparkFun-Capacitors:0.1UF: 0.1µF ceramic capacitors A capacitor is a passive two-terminal electrical component used to store electrical energy temporarily in an electric field.; PROD_ID: CAP-08604
C13 C15 C17 C20 C22 = SparkFun-Capacitors:10UF: 10.0µF ceramic capacitors A capacitor is a passive two-terminal electrical component used to store electrical energy temporarily in an electric field.; PROD_ID: CAP-11015
C14 C16 C18 = SparkFun-Capacitors:10UF: 10.0µF ceramic capacitors A capacitor is a passive two-terminal electrical component used to store electrical energy temporarily in an electric field.; PROD_ID: CAP-11015; VALUE: 10uF
D4-D15 = SparkFun-LED:LED: LED (Generic) Standard schematic elements and footprints for 5mm, 3mm, 1206, and 0603 sized LEDs. Generic LEDs with no color specified.
FLASH SD_CARD = Connector:PINHD-2X6: PIN HEADER; CATEGORY: CONNECTOR; SUB-CATEGORY: PIN-HEADER
GND = Connector:PINHD-2X3: PIN HEADER; CATEGORY: CONNECTOR; SUB-CATEGORY: PIN-HEADER
H1-H8 = holes:MOUNT-HOLE: MOUNTING HOLE with drill center marker
IC1 IC3 IC4 = SamacSys_Parts:SN74AVC4T774PWR: 4-Bit Dual-Supply Bus Transceiver With Configurable Voltage-Level Shifting and 3-State Outputs Source: Datasheet <http://www.ti.com/lit/gpn/sn74avc4t774>; ARROW_PART_NUMBER: SN74AVC4T774PWR; ARROW_PRICE-STOCK: https://www.arrow.com/en/products/sn74avc4t774pwr/texas-instruments?region=nac; DESCRIPTION: 4-Bit Dual-Supply Bus Transceiver With Configurable Voltage-Level Shifting and 3-State Outputs; HEIGHT: 1.2mm; MANUFACTURER_NAME: Texas Instruments; MANUFACTURER_PART_NUMBER: SN74AVC4T774PWR; MOUSER_PART_NUMBER: 595-SN74AVC4T774PWR; MOUSER_PRICE-STOCK: https://www.mouser.co.uk/ProductDetail/Texas-Instruments/SN74AVC4T774PWR?qs=WxL8HmPi5r562Eu%2F2kE2LA%3D%3D
IC7-IC9 = SamacSys_Parts:LM1117MP-1.8_NOPB: Space saving 800-mA low-dropout linear regulator with internal current limit Source: Datasheet <http://docs-emea.rs-online.com/webdocs/05bb/0900766b805bb323.pdf>; ARROW_PART_NUMBER: LM1117MP-1.8/NOPB; ARROW_PRICE-STOCK: https://www.arrow.com/en/products/lm1117mp-1.8nopb/texas-instruments; DESCRIPTION: Space saving 800-mA low-dropout linear regulator with internal current limit; HEIGHT: 1.8mm; MANUFACTURER_NAME: Texas Instruments; MANUFACTURER_PART_NUMBER: LM1117MP-1.8/NOPB; MOUSER_PART_NUMBER: 926-LM1117MP-1.8NOPB; MOUSER_PRICE-STOCK: https://www.mouser.co.uk/ProductDetail/Texas-Instruments/LM1117MP-18-NOPB?qs=X1J7HmVL2ZHoIMlImSU1JA%3D%3D
J4 J5 = SamacSys_Parts:2985-6004: RF Connectors / Coaxial Connectors SMA F PCB Thru-Hole Conn, 50-OHMS 1000 Source: Datasheet <https://componentsearchengine.com//2985-6004.pdf>; DESCRIPTION: RF Connectors / Coaxial Connectors SMA F PCB Thru-Hole Conn, 50-OHMS 1000; HEIGHT: 9.54mm; MANUFACTURER_NAME: Amphenol; MANUFACTURER_PART_NUMBER: 2985-6004; MOUSER_PART_NUMBER: 523-2985-6004; MOUSER_PRICE-STOCK: https://www.mouser.co.uk/ProductDetail/Amphenol-SV-Microwave/2985-6004?qs=jyo2EwfRkUNkt8LGijRXFQ%3D%3D
JP1-JP3 = adafruit:PINHD-2X4: PIN HEADER
JP4 JP10 = pinhead:PINHD-2X8: PIN HEADER
JP5 JP6 JP24 = pinhead:PINHD-2X2: PIN HEADER
JP8 USB-UART = Connector:PINHD-2X4: PIN HEADER; CATEGORY: CONNECTOR; SUB-CATEGORY: PIN-HEADER
JP18-JP21 = pinhead:PINHD-2X20: PIN HEADER
JTAG_20_PIN = pinhead:PINHD-2X10: PIN HEADER
Q3-Q13 = SamacSys_Parts:BSH103,235: MOSFET TAPE13 MOSFET Source: Datasheet <http://www.nxp.com/documents/data_sheet/BSH103.pdf>; DESCRIPTION: MOSFET TAPE13 MOSFET; HEIGHT: 1.1mm; MANUFACTURER_NAME: Nexperia; MANUFACTURER_PART_NUMBER: BSH103,235; MOUSER_PART_NUMBER: 771-BSH103235; MOUSER_PRICE-STOCK: https://www.mouser.co.uk/ProductDetail/Nexperia/BSH103235?qs=me8TqzrmIYVhbJIwsR7ziw%3D%3D
R1 R3 R5 = SparkFun-Resistors:15KOHM: 15kΩ resistor A resistor is a passive two-terminal electrical component that implements electrical resistance as a circuit element. Resistors act to reduce current flow, and, at the same time, act to lower voltage levels within circuits. - Wikipedia; PROD_ID: RES-07854
R2 R4 R6 = SparkFun-Resistors:6.8KOHM: 6.8kΩ resistor A resistor is a passive two-terminal electrical component that implements electrical resistance as a circuit element. Resistors act to reduce current flow, and, at the same time, act to lower voltage levels within circuits. - Wikipedia; PROD_ID: RES-08597
R9 R10 R17 R22-R33 R58-R71 = SparkFun-Resistors:10KOHM: 10kΩ resistor A resistor is a passive two-terminal electrical component that implements electrical resistance as a circuit element. Resistors act to reduce current flow, and, at the same time, act to lower voltage levels within circuits. - Wikipedia; PROD_ID: RES-00824
R46-R57 = SparkFun-Resistors:330OHM: 330Ω resistor A resistor is a passive two-terminal electrical component that implements electrical resistance as a circuit element. Resistors act to reduce current flow, and, at the same time, act to lower voltage levels within circuits. - Wikipedia; PROD_ID: RES-00818
S1 = SamacSys_Parts:DSHP03TSGET: DIP Switches SPST 3 1.27mm, Half SMD RoHS Source: Datasheet <https://datasheet.lcsc.com/szlcsc/Dongguan-Guangzhu-Industrial-DSHP03TSGET_C50844.pdf>; DESCRIPTION: DIP Switches SPST 3 1.27mm, Half SMD RoHS; HEIGHT: 2.6mm; MANUFACTURER_NAME: Dongguan Guangzhu Industrial; MANUFACTURER_PART_NUMBER: DSHP03TSGET
S1_DIP8 = SamacSys_Parts:219-8LPST: DIP Switches / SIP Switches SPST 8 switch sections Source: Datasheet <https://www.ctscorp.com/wp-content/uploads/219.pdf>; ARROW_PART_NUMBER: 219-8LPST; ARROW_PRICE-STOCK: https://www.arrow.com/en/products/219-8lpst/cts; DESCRIPTION: DIP Switches / SIP Switches SPST 8 switch sections; HEIGHT: 4.2mm; MANUFACTURER_NAME: CTS; MANUFACTURER_PART_NUMBER: 219-8LPST; MOUSER_PART_NUMBER: 774-2198LPST; MOUSER_PRICE-STOCK: https://www.mouser.co.uk/ProductDetail/CTS-Electronic-Components/219-8LPST?qs=qNzHFtQhdJ%252BArk7b%252BY2Vjw%3D%3D
SOCKET_1-SOCKET_8 = pinhead:PINHD-2X16: PIN HEADER